# Altium schematic sheet OSCILLAR_HFB_V1p0_INT.SchDoc
size A4; SheetNumber: 3; SheetTotal: 15
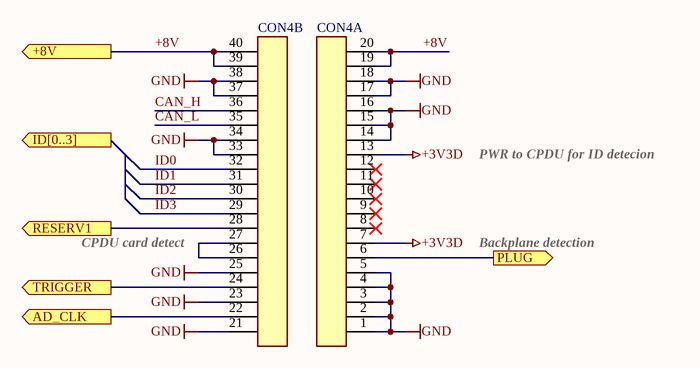
[diagram p0: OSCILLAR_HFB_V1p0_INT.SchDoc]

## Parts
CON4  CON2x20  [CON40_SIMPLE_TH_2x20]  (value not drawn)  (parts A,B of 2)

## Ports
+8V (out, see OSCILLAR_HFB_V1p0_MAIN[1B]), AD_CLK (out, see OSCILLAR_HFB_V1p0_MAIN[1B]), ID[0..3] (out, see OSCILLAR_HFB_V1p0_MAIN[1B]), PLUG (out, see OSCILLAR_HFB_V1p0_MAIN[1B]), RESERV1 (out, see OSCILLAR_HFB_V1p0_MAIN[1B]), TRIGGER (out, see OSCILLAR_HFB_V1p0_MAIN[1B])

## Nets
+3V3D: CON4.7 CON4.13
GND: CON4.1 CON4.2 CON4.3 CON4.4 CON4.5 CON4.14 CON4.15 CON4.16 CON4.17 CON4.18 CON4.21 CON4.23 CON4.25 CON4.33 CON4.34 CON4.37 CON4.38
+8V: CON4.19 CON4.20 CON4.39 CON4.40 ; port +8V
AD_CLK: CON4.22 ; port AD_CLK
CAN_H: CON4.36
CAN_L: CON4.35
ID0: CON4.32
ID1: CON4.31
ID2: CON4.30
ID3: CON4.29
PLUG: CON4.6 ; port PLUG
RESERV1: CON4.28 ; port RESERV1
TRIGGER: CON4.24 ; port TRIGGER
NetCON4_26: CON4.26 CON4.27

Not connected (* = marked no-connect by the designer): CON4 8* 9* 10* 11* 12*

## Notes on the sheet
- PWR to CPDU for ID detecion
- CPDU card detect
- Backplane detection
- Board:
- Author:
- Title:
- Project:
- SVN:
- Version:
- Sheet:
- of
- Contact:
- Modified:
- Size:
- A4

## Library data of the parts
CON4 = CON2x20: Simple 2x20pin THT, 2.54mm; Type: CON